# Altium schematic sheet Z7_STORAGE.SchDoc
size A3
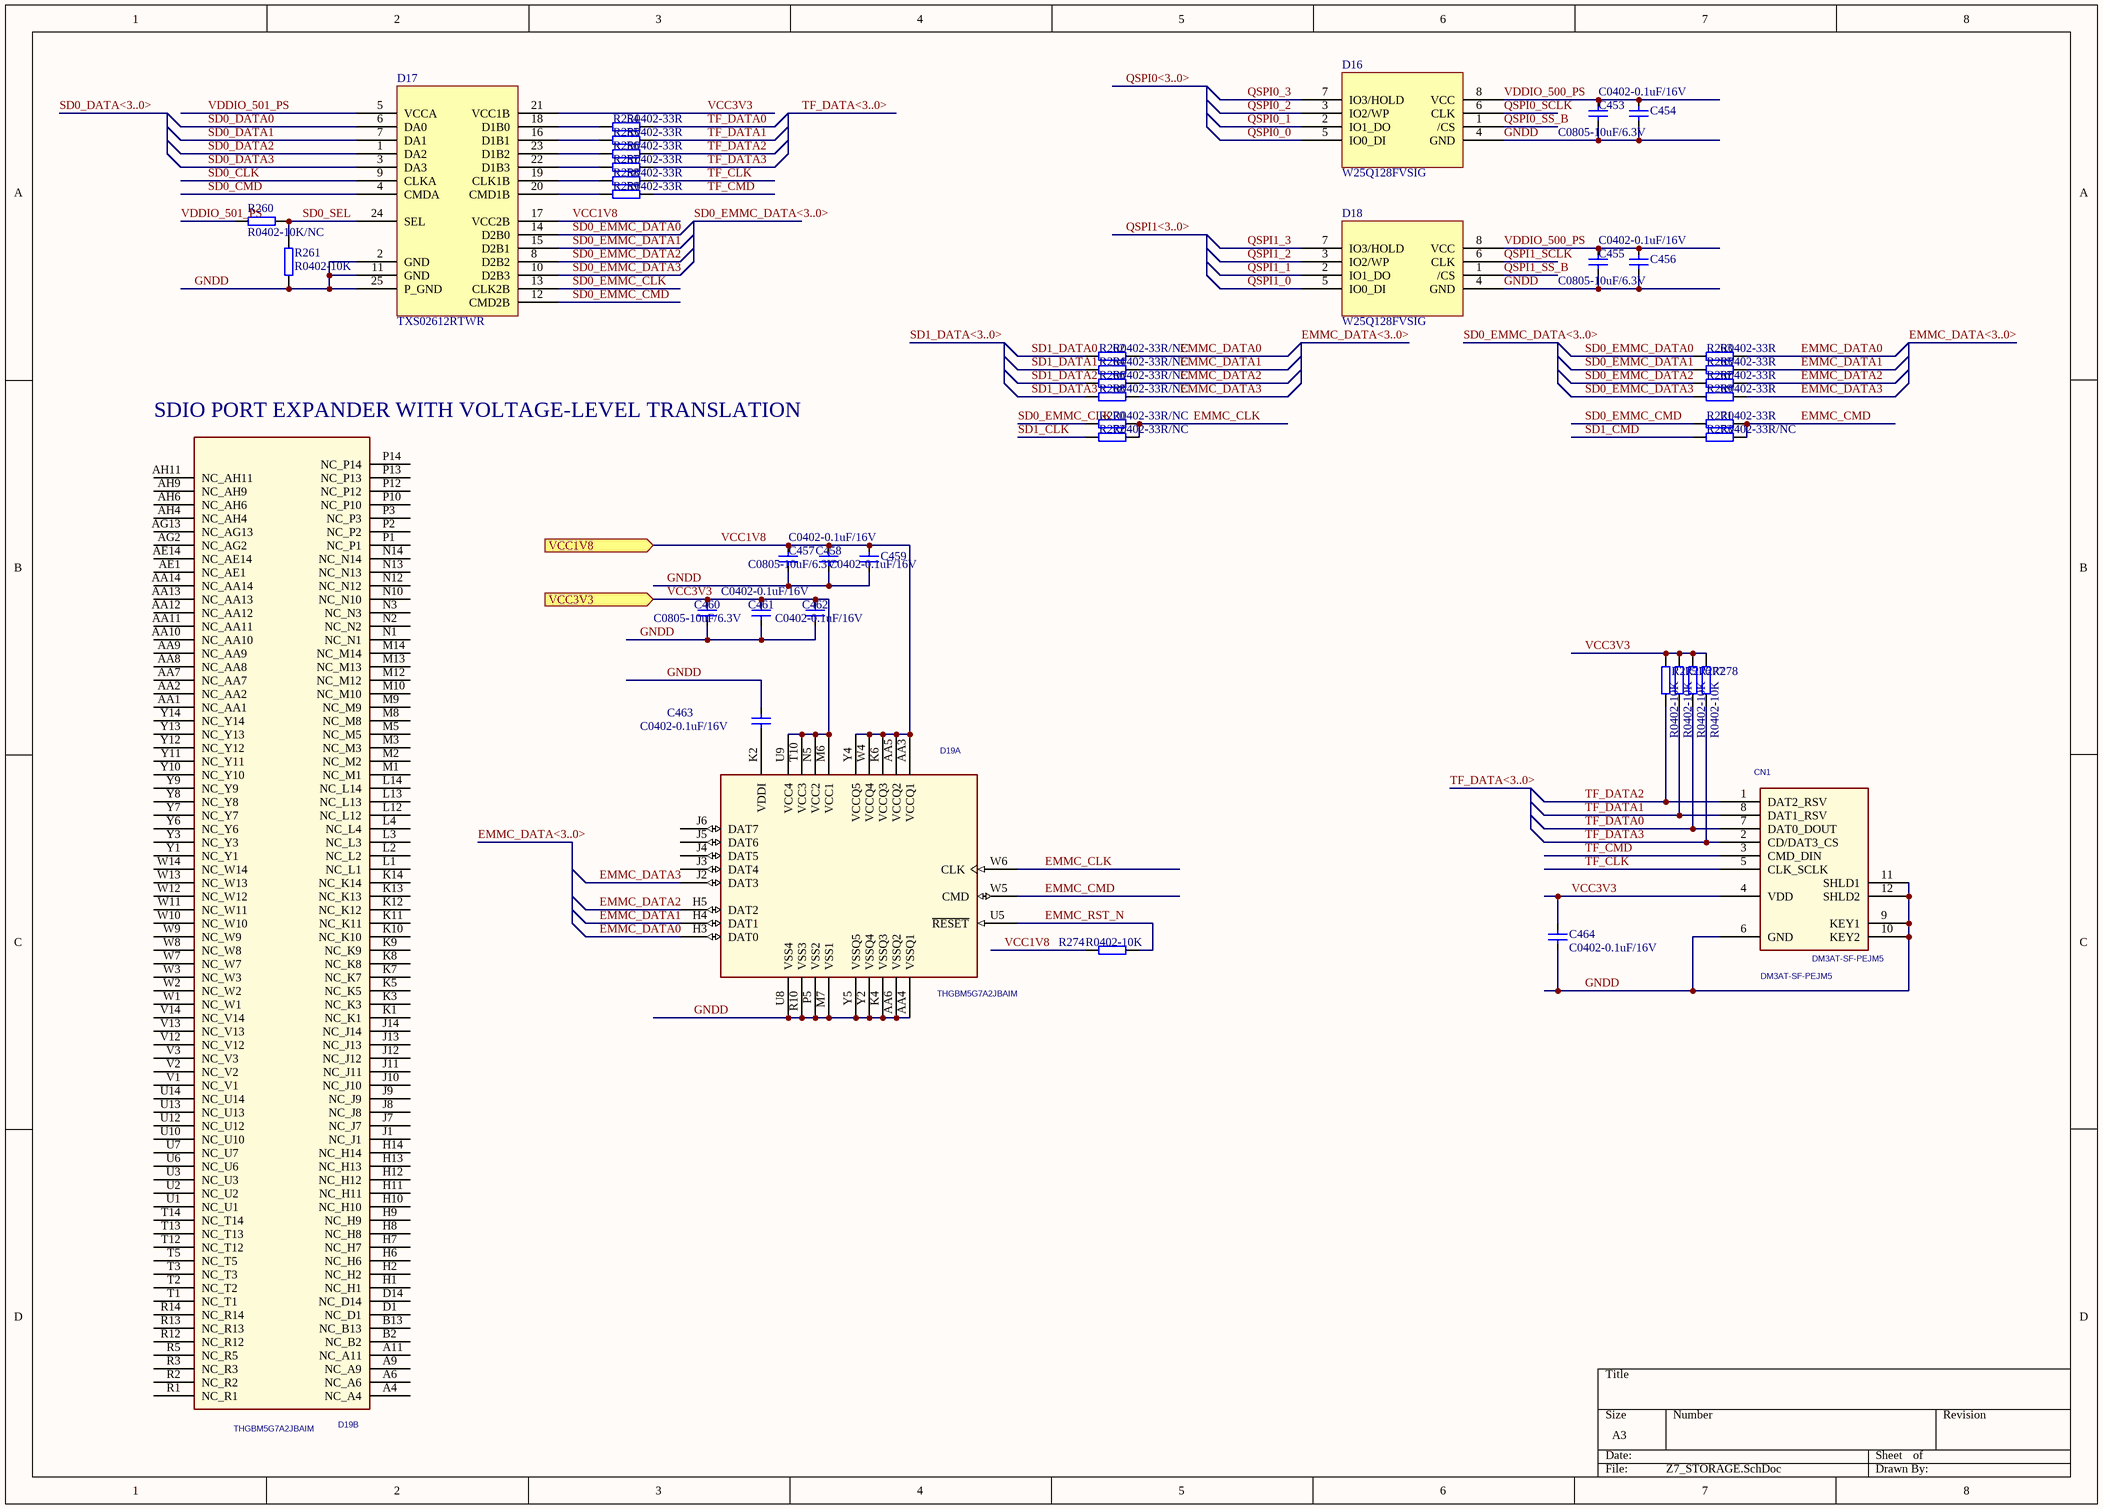
[diagram p0: Z7_STORAGE.SchDoc]

## Parts
C453  C0805-10uF/6.3V  [C0805]
C454  C0402-0.1uF/16V  [C0402]
C455  C0805-10uF/6.3V  [C0805]
C456  C0402-0.1uF/16V  [C0402]
C457  C0805-10uF/6.3V  [C0805]
C458  C0402-0.1uF/16V  [C0402]
C459  C0402-0.1uF/16V  [C0402]
C460  C0805-10uF/6.3V  [C0805]
C461  C0402-0.1uF/16V  [C0402]
C462  C0402-0.1uF/16V  [C0402]
C463  C0402-0.1uF/16V  [C0402]
C464  C0402-0.1uF/16V  [C0402]
CN1  DM3AT-SF-PEJM5  [HRS-SD]
D16  W25Q128FVSIG  [SOIC-W8]
D17  TXS02612RTWR  [QFN-24]
D18  W25Q128FVSIG  [SOIC-W8]
D19  THGBM5G7A2JBAIM  [BGA-169]  (parts A,B of 2)
R254  R0402-33R  [R0402]
R255  R0402-33R  [R0402]
R256  R0402-33R  [R0402]
R257  R0402-33R  [R0402]
R258  R0402-33R  [R0402]
R259  R0402-33R  [R0402]
R260  R0402-10K/NC  [R0402]
R261  R0402-10K  [R0402]
R262  R0402-33R/NC  [R0402]
R263  R0402-33R  [R0402]
R264  R0402-33R/NC  [R0402]
R265  R0402-33R  [R0402]
R266  R0402-33R/NC  [R0402]
R267  R0402-33R  [R0402]
R268  R0402-33R/NC  [R0402]
R269  R0402-33R  [R0402]
R270  R0402-33R/NC  [R0402]
R271  R0402-33R  [R0402]
R272  R0402-33R/NC  [R0402]
R273  R0402-33R/NC  [R0402]
R274  R0402-10K  [R0402]
R275  R0402-10K  [R0402]
R276  R0402-10K  [R0402]
R277  R0402-10K  [R0402]
R278  R0402-10K  [R0402]

## Ports
VCC1V8 (in), VCC3V3 (in)

## Nets
EMMC_CLK: D19.W6(CLK) R270.2 R272.2
EMMC_CMD: D19.W5(CMD) R271.2 R273.2
EMMC_DATA0: D19.H3(DAT0) R262.2 R263.2
EMMC_DATA1: D19.H4(DAT1) R264.2 R265.2
EMMC_DATA2: D19.H5(DAT2) R266.2 R267.2
EMMC_DATA3: D19.J2(DAT3) R268.2 R269.2
EMMC_RST_N: D19.U5(~{RESET}) R274.2
GNDD: C453.2 C454.1 C455.2 C456.1 C457.2 C458.1 C459.1 C460.2 C461.1 C462.1 C463.2 C464.1 CN1.6(GND) CN1.9(KEY1) CN1.10(KEY2) CN1.11(SHLD1) CN1.12(SHLD2) D16.4(GND) D17.2(GND) D17.11(GND) D17.25(P_GND) D18.4(GND) D19.AA4(VSSQ1) D19.AA6(VSSQ2) D19.K4(VSSQ3) D19.M7(VSS1) D19.P5(VSS2) D19.R10(VSS3) D19.U8(VSS4) D19.Y2(VSSQ4) D19.Y5(VSSQ5) R261.1
QSPI0_0: D16.5(IO0_DI)
QSPI0_1: D16.2(IO1_DO)
QSPI0_2: D16.3(IO2/WP)
QSPI0_3: D16.7(IO3/HOLD)
QSPI0_SCLK: D16.6(CLK)
QSPI0_SS_B: D16.1(/CS)
QSPI1_0: D18.5(IO0_DI)
QSPI1_1: D18.2(IO1_DO)
QSPI1_2: D18.3(IO2/WP)
QSPI1_3: D18.7(IO3/HOLD)
QSPI1_SCLK: D18.6(CLK)
QSPI1_SS_B: D18.1(/CS)
SD0_CLK: D17.9(CLKA)
SD0_CMD: D17.4(CMDA)
SD0_DATA0: D17.6(DA0)
SD0_DATA1: D17.7(DA1)
SD0_DATA2: D17.1(DA2)
SD0_DATA3: D17.3(DA3)
SD0_EMMC_CLK: D17.13(CLK2B) R270.1
SD0_EMMC_CMD: D17.12(CMD2B) R271.1
SD0_EMMC_DATA0: D17.14(D2B0) R263.1
SD0_EMMC_DATA1: D17.15(D2B1) R265.1
SD0_EMMC_DATA2: D17.8(D2B2) R267.1
SD0_EMMC_DATA3: D17.10(D2B3) R269.1
SD0_SEL: D17.24(SEL) R260.1 R261.2
SD1_CLK: R272.1
SD1_CMD: R273.1
SD1_DATA0: R262.1
SD1_DATA1: R264.1
SD1_DATA2: R266.1
SD1_DATA3: R268.1
TF_CLK: CN1.5(CLK_SCLK) R258.2
TF_CMD: CN1.3(CMD_DIN) R259.2
TF_DATA0: CN1.7(DAT0_DOUT) R254.2 R277.2
TF_DATA1: CN1.8(DAT1_RSV) R255.2 R276.2
TF_DATA2: CN1.1(DAT2_RSV) R256.2 R275.2
TF_DATA3: CN1.2(CD/DAT3_CS) R257.2 R278.2
VCC1V8: C457.1 C458.2 C459.2 D17.17(VCC2B) D19.AA3(VCCQ1) D19.AA5(VCCQ2) D19.K6(VCCQ3) D19.W4(VCCQ4) D19.Y4(VCCQ5) R274.1 ; port VCC1V8
VCC3V3: C460.1 C461.2 C462.2 C464.2 CN1.4(VDD) D17.21(VCC1B) D19.M6(VCC1) D19.N5(VCC2) D19.T10(VCC3) D19.U9(VCC4) R275.1 R276.1 R277.1 R278.1 ; port VCC3V3
VDDIO_500_PS: C453.1 C454.2 C455.1 C456.2 D16.8(VCC) D18.8(VCC)
VDDIO_501_PS: D17.5(VCCA) R260.2
NetC463_1: C463.1 D19.K2(VDDI)
NetD17_16: D17.16(D1B1) R255.1
NetD17_18: D17.18(D1B0) R254.1
NetD17_19: D17.19(CLK1B) R258.1
NetD17_20: D17.20(CMD1B) R259.1
NetD17_22: D17.22(D1B3) R257.1
NetD17_23: D17.23(D1B2) R256.1

Not connected (* = marked no-connect by the designer): D19 A4(NC_A4) A6(NC_A6) A9(NC_A9) A11(NC_A11) AA1(NC_AA1) AA2(NC_AA2) AA7(NC_AA7) AA8(NC_AA8) AA9(NC_AA9) AA10(NC_AA10) AA11(NC_AA11) AA12(NC_AA12) AA13(NC_AA13) AA14(NC_AA14) AE1(NC_AE1) AE14(NC_AE14) AG2(NC_AG2) AG13(NC_AG13) AH4(NC_AH4) AH6(NC_AH6) AH9(NC_AH9) AH11(NC_AH11) B2(NC_B2) B13(NC_B13) D1(NC_D1) D14(NC_D14) H1(NC_H1) H2(NC_H2) H6(NC_H6) H7(NC_H7) H8(NC_H8) H9(NC_H9) H10(NC_H10) H11(NC_H11) H12(NC_H12) H13(NC_H13) H14(NC_H14) J1(NC_J1) J3(DAT4) J4(DAT5) J5(DAT6) J6(DAT7) J7(NC_J7) J8(NC_J8) J9(NC_J9) J10(NC_J10) J11(NC_J11) J12(NC_J12) J13(NC_J13) J14(NC_J14) K1(NC_K1) K3(NC_K3) K5(NC_K5) K7(NC_K7) K8(NC_K8) K9(NC_K9) K10(NC_K10) K11(NC_K11) K12(NC_K12) K13(NC_K13) K14(NC_K14) L1(NC_L1) L2(NC_L2) L3(NC_L3) L4(NC_L4) L12(NC_L12) L13(NC_L13) L14(NC_L14) M1(NC_M1) M2(NC_M2) M3(NC_M3) M5(NC_M5) M8(NC_M8) M9(NC_M9) M10(NC_M10) M12(NC_M12) M13(NC_M13) M14(NC_M14) N1(NC_N1) N2(NC_N2) N3(NC_N3) N10(NC_N10) N12(NC_N12) N13(NC_N13) N14(NC_N14) P1(NC_P1) P2(NC_P2) P3(NC_P3) P10(NC_P10) P12(NC_P12) P13(NC_P13) P14(NC_P14) R1(NC_R1) R2(NC_R2) R3(NC_R3) R5(NC_R5) R12(NC_R12) R13(NC_R13) R14(NC_R14) T1(NC_T1) T2(NC_T2) T3(NC_T3) T5(NC_T5) T12(NC_T12) T13(NC_T13) T14(NC_T14) U1(NC_U1) U2(NC_U2) U3(NC_U3) U6(NC_U6) U7(NC_U7) U10(NC_U10) U12(NC_U12) U13(NC_U13) U14(NC_U14) V1(NC_V1) V2(NC_V2) V3(NC_V3) V12(NC_V12) V13(NC_V13) V14(NC_V14) W1(NC_W1) W2(NC_W2) W3(NC_W3) W7(NC_W7) W8(NC_W8) W9(NC_W9) W10(NC_W10) W11(NC_W11) W12(NC_W12) W13(NC_W13) W14(NC_W14) Y1(NC_Y1) Y3(NC_Y3) Y6(NC_Y6) Y7(NC_Y7) Y8(NC_Y8) Y9(NC_Y9) Y10(NC_Y10) Y11(NC_Y11) Y12(NC_Y12) Y13(NC_Y13) Y14(NC_Y14)

## Buses and harness runs
bus EMMC_DATA<3..0>
bus QSPI0<3..0>
bus QSPI1<3..0>
bus SD0_DATA<3..0>
bus SD0_EMMC_DATA<3..0>
bus SD1_DATA<3..0>
bus TF_DATA<3..0>

## Notes on the sheet
- (near D19) SDIO PORT EXPANDER WITH VOLTAGE-LEVEL TRANSLATION

## Library data of the parts
C453 C455 C457 C460 = C1210-22uF/16V: Part_number: C0805-10uF/6.3V; Part_type: CAP; Value: C0805-10uF/6.3V; Schematic_Part: CAP; PCB_Footprint: C0805
C454 C456 C458 C459 C461-C464 = C0402-0.1uF/16V: X7R; Manufacturer: SAMSUNG; Manufacturer_p/n: CL05X7R104KO5NNN; Part_number: C0402-0.1uF/16V; Part_type: CAP; Value: C0402-0.1uF/16V; temperature: -55℃\+125℃; Schematic_Part: CAP; PCB_Footprint: C0402; datasheet: #DataSheet\C_Samsung_General Capacitors.pdf#
CN1 = HRS-SD: Part_number: DM3AT-SF-PEJM5
D17 = TXS02612: Part_number: TXS02612RTWR
D19 = SDIN5C2_TFBGA_169P: IC INAND MEM FLASH 8GB 2.7-3.6V TFBGA169; CAD_APPROVED: Yes; MFG_NAME01: SANDISK CORPORATION; AGILE_PN: 342-00495; CLASS: IC; HEIGHT: 1.2MM; ROHS: Yes; MFG_PN01: THGBM5G7A2JBAIM; partnumber: THGBM5G7A2JBAIM
R254-R278 = R0402-10K: Manufacturer: SAMSUNG; Part_type: RES; Schematic_Part: RES; PCB_Footprint: R0402
  R254-R259 R263 R265 R267 R269 R271: Part_number: R0402-33R; Value: R0402-33R
  R260: Part_number: R0402-10K/NC; Value: R0402-10K/NC
  R261 R274-R278: Part_number: R0402-10K; Value: R0402-10K
  R262 R264 R266 R268 R270 R272 R273: Part_number: R0402-33R/NC; Value: R0402-33R/NC
D16 D18 = W25Q128FVSIG: Part_number: W25Q128FVSIG